# Altium project UTHP Truck Cape.PrjPcb (part 2 of 2)

## Sheet UTHP J1708 LIN RTC.SchDoc: Ultimate Truck Hacking Platform
size Letter; Author: Systems Cyber Research Group; Address1: Jeremy Daily; Address2: Thomas Balzer; Address3: Carson Green; Address4: Fort Collins, CO; DocumentNumber: I2C and J1708; Revision: 1; SheetNumber: 6; SheetTotal: 6; ENG_APP_DATE: --/--/--; DSN_APP_DATE: --/--/--; CHK_APP_DATE: --/--/--
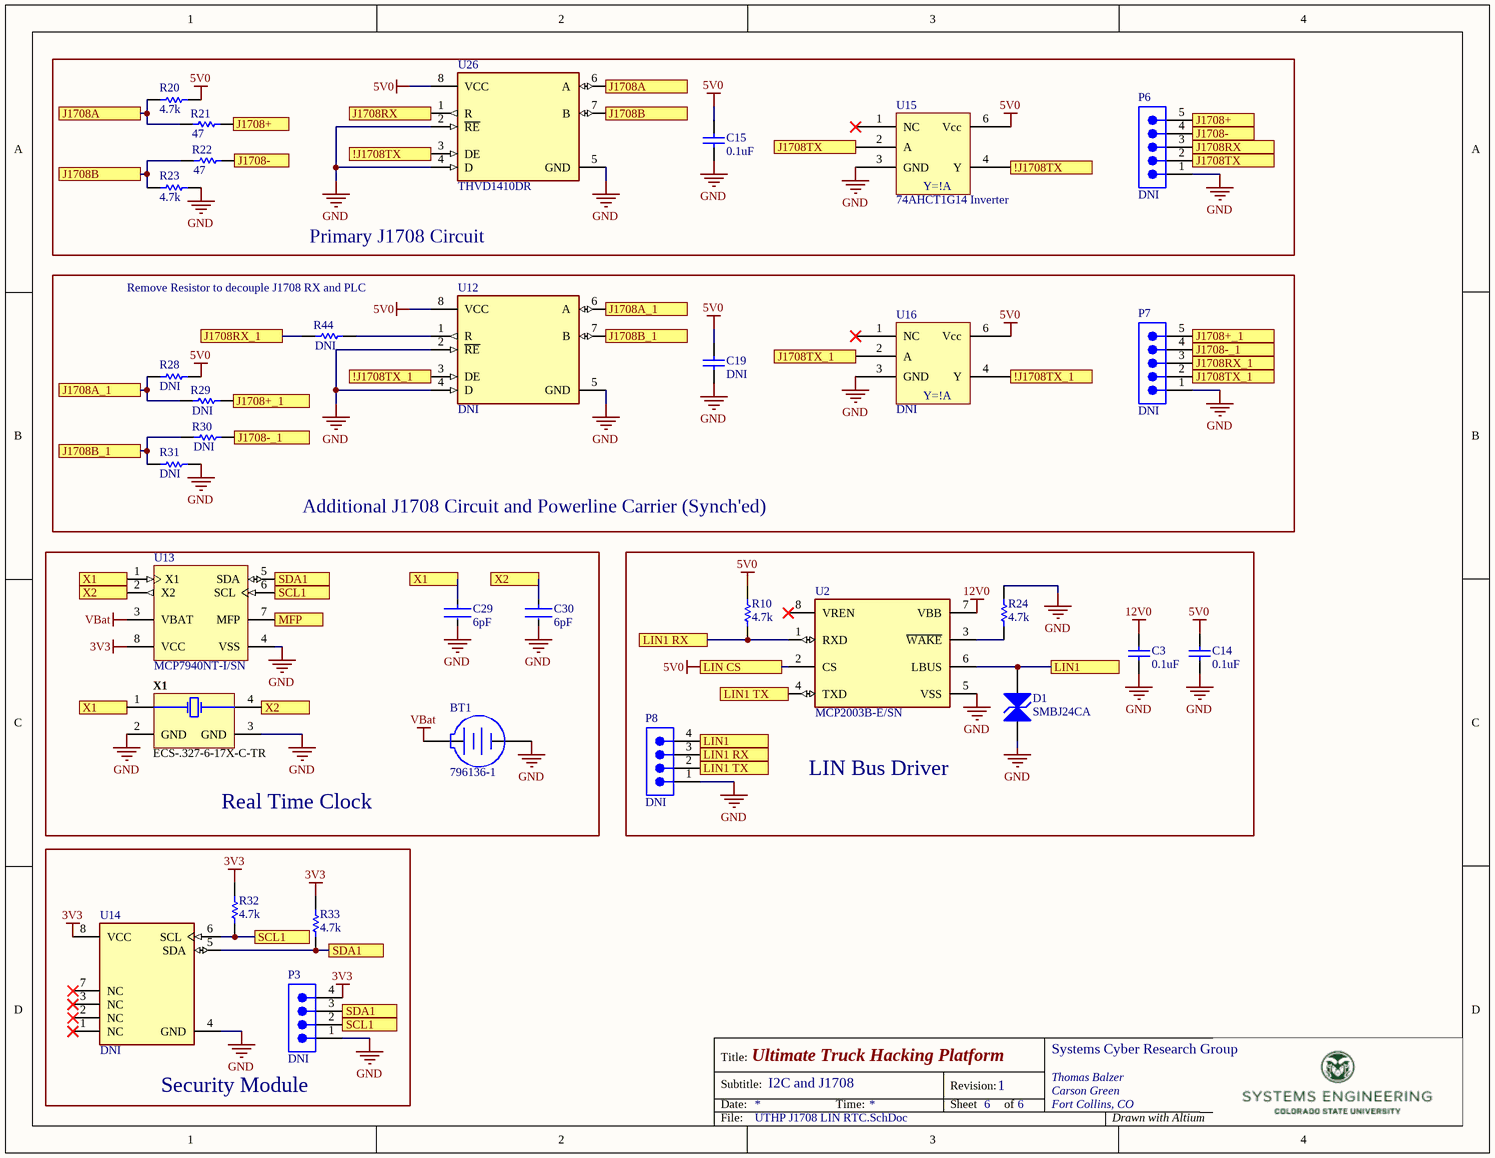
[diagram p5: UTHP J1708 LIN RTC.SchDoc]

### Parts
BT1  796136-1  [TECO-796136-1_V]
C3  0.1uF  [CAPC1608X90X35LL15T15]
C14  0.1uF  [CAPC1608X90X35LL15T15]
C15  0.1uF  [CAPC1608X90X35LL15T15]
C19  DNI  [CAPC1608X90X35LL15T15]
C29  6pF  [FP-CGA3E-0_3-0_1-MFG]
C30  6pF  [FP-CGA3E-0_3-0_1-MFG]
D1  SMBJ24CA  [VISH-DO-214AA-A-2_V]
P3  DNI  [61300411121]
P6  DNI  [61300511121]
P7  DNI  [61300511121]
P8  DNI  [61300411121]
R10  4.7k  [RESC1608X55X30NL15T15]
R20  4.7k  [RESC1608X55X30NL15T15]
R21  47  [RESC1609X50X30LL10T20]
R22  47  [RESC1609X50X30LL10T20]
R23  4.7k  [RESC1608X55X30NL15T15]
R24  4.7k  [RESC1608X55X30NL15T15]
R28  DNI  [RESC1608X55X30NL15T15]
R29  DNI  [RESC1609X50X30LL10T20]
R30  DNI  [RESC1609X50X30LL10T20]
R31  DNI  [RESC1608X55X30NL15T15]
R32  4.7k  [RESC1608X55X30NL15T15]
R33  4.7k  [RESC1608X55X30NL15T15]
R44  DNI  [RESC1609X50X30LL10T20]
U2  MCP2003B-E/SN  [FP-C04-057-IPC_B]
U12  DNI  [FP-D0008A-IPC_B]
U13  MCP7940NT-I/SN  [SOIC-SN8_M]
U14  DNI  [FP-C04-057-OA-MFG]
U15  74AHCT1G14 Inverter  [SOT-353]
U16  DNI  [SOT-353]
U26  THVD1410DR  [FP-D0008A-IPC_B]
X1  ECS-.327-6-17X-C-TR  [ECS-.327-6-17X-C-TR-Footprint-1]

### Blocks framed on the sheet
Primary J1708 Circuit: C15 P6 R20-R23 U15 U26
Additional J1708 Circuit and Powerline Carrier (Synch'ed): C19 P7 R28-R31 R44 U12 U16
Real Time Clock: BT1 C29 C30 U13 X1
LIN Bus Driver: C3 C14 D1 P8 R10 R24 U2
Security Module: P3 R32 R33 U14

### Ports
!J1708TX, !J1708TX_1, J1708+, J1708+_1, J1708-, J1708-_1, J1708A, J1708A_1, J1708B, J1708B_1, J1708RX, J1708RX_1, J1708TX, J1708TX_1, LIN1, LIN1 RX, LIN1 TX, LIN CS, MFP, SCL1, SDA1, X1, X2

### Nets
3V3: P3.4 R32.1 R33.1 U13.8(VCC) U14.8(VCC)
5V0: C14.1 C15.1 C19.1 R10.2 R20.1 R28.1 U2.2(CS) U12.8(VCC) U15.6(Vcc) U16.6(Vcc) U26.8(VCC) ; port LIN CS
12V0: C3.1 U2.7(VBB)
GND: BT1.2(-) C3.2 C14.2 C15.2 C19.2 C29.2 C30.2 D1.1(A) P3.1 P6.1 P7.1 P8.1 R23.1 R24.2 R31.1 U2.5(VSS) U12.2(~{RE}) U12.4(D) U12.5(GND) U13.4(VSS) U14.4(GND) U15.3(GND) U16.3(GND) U26.2(~{RE}) U26.4(D) U26.5(GND) X1.2(GND) X1.3(GND)
VBat: BT1.1(+) U13.3(VBAT)
!J1708TX: U15.4(Y) U26.3(DE) ; port !J1708TX
!J1708TX_1: U12.3(DE) U16.4(Y) ; port !J1708TX_1
J1708+: P6.5 R21.2 ; port J1708+
J1708+_1: P7.5 R29.2 ; port J1708+_1
J1708-: P6.4 R22.2 ; port J1708-
J1708-_1: P7.4 R30.2 ; port J1708-_1
J1708A: R20.2 R21.1 U26.6(A) ; port J1708A
J1708A_1: R28.2 R29.1 U12.6(A) ; port J1708A_1
J1708B: R22.1 R23.2 U26.7(B) ; port J1708B
J1708B_1: R30.1 R31.2 U12.7(B) ; port J1708B_1
J1708RX: P6.3 U26.1(R) ; port J1708RX
J1708RX_1: P7.3 R44.1 ; port J1708RX_1
J1708TX: P6.2 U15.2(A) ; port J1708TX
J1708TX_1: P7.2 U16.2(A) ; port J1708TX_1
LIN1: D1.2(A) P8.4 U2.6(LBUS) ; port LIN1
LIN1 RX: P8.3 R10.1 U2.1(RXD) ; port LIN1 RX
LIN1 TX: P8.2 U2.4(TXD) ; port LIN1 TX
MFP: U13.7(MFP) ; port MFP
SCL1: P3.2 R32.2 U13.6(SCL) U14.6(SCL) ; port SCL1
SDA1: P3.3 R33.2 U13.5(SDA) U14.5(SDA) ; port SDA1
X1: C29.1 U13.1(X1) X1.1(X1) ; port X1
X2: C30.1 U13.2(X2) X1.4(X2) ; port X2
NetR24_1: R24.1 U2.3(~{WAKE})
NetR44_2: R44.2 U12.1(R)

Not connected (* = marked no-connect by the designer): U2 8(VREN)*; U14 1(NC)* 2(NC)* 3(NC)* 7(NC)*; U15 1(NC)*; U16 1(NC)*

### Notes on the sheet
- (near R44) Remove Resistor to decouple J1708 RX and PLC
- Title:
- Subtitle:
- Date:
- Time:
- Revision:
- Sheet
- of
- File:
- Drawn with Altium
- (in symbol CMP-023-000006-1) Y=!A

### Library data of the parts
BT1 = CMP-002-00002-2: Battery Connector, 1 Cell, CR2032, 2-Pin SMD, RoHS, Tape and Reel; Manufacturer: TE Connectivity; Max Voltage Rating (AC): 30V; Connector Type: BatteryHolder; Batteries: 1; Datasheet URL: http://www.te.com/commerce/DocumentDelivery/DDEController?Action=srchrtrv&DocNm=796136&DocType=Customer+Drawing&DocLang=English&DocFormat=pdf&PartCntxt=796136-1; Contact Plating: Tin; Case/Package: 796136-1; Colour: Black; Package Reference: 796136-1; Package Quantity: 400; Pins: 2; Mounting Technology: SM; RoHS Compliant: True; Datasheet Version: Dec-13; Package Description: 2-Pin Surface Mount Device, Body 32.31 x 19.05 mm; Packaging: TapeandReel; Manufacturer URL: http://www.te.com/; Contact Material: Bronze
C3 C14 C15 = CMP-2006-04387-1: 0.1 µF ±10% 50V Ceramic Capacitor X7R 0603 (1608 Metric); Manufacturer: KYOCERA AVX; Part Number: KAM15AR71H104KM; Supplier 1: Digi-Key; Supplier Part Number 1: 478-KAM15AR71H104KMTR-ND; Value: 0.1uF
C19 = CMP-2006-04387-1: 0.1 µF ±10% 50V Ceramic Capacitor X7R 0603 (1608 Metric); Manufacturer: KYOCERA AVX; Part Number: KAM15AR71H104KM; Value: 0.1uF; Supplier 1: Digi-Key; Supplier Part Number 1: 478-KAM15AR71H104KMTR-ND
C29 C30 = CMP-08246-001317-1: Cap Ceramic 6pF 50V C0G 0.5pF Pad SMD 0603 +125°C Automotive T/R CGA3E2C0G1H060D080AA; Manufacturer: TDK Corporation; Part Number: CGA3E2C0G1H060D080AA; Supplier 1: Digi-Key; Supplier Part Number 1: 445-5623-1-ND; Value: 6pF
D1 = CMP-2000-07094-1: TRANSZORB(R) Transient Voltage Suppressor, 24 V, -55 to 150 degC, 2-Pin DO-214AA (SMBJ), RoHS, Tape and Reel; Manufacturer: Vishay; Part Number: SMBJ24CA-E3/52; Value: TVS Diode; Supplier 1: Digi-Key; Supplier Part Number 1: SMBJ24CA-E3/52GICT-ND
P3 = CMP-1502-01064-2
P6 P7 = CMP-1502-01068-2: NexarPartId: 32855526; Operating Supply Voltage: 250V; Number of Contacts: 5; Connector Type: Male Pin; Current Rating: 3A; Contact Resistance: 20mΩ; Pitch: 2.54mm; Gender: Male; Termination: Solder; RoHS: Compliant; Lead Pitch: 2.54mm; Contact Mating Length: 5.9944mm; Number of Positions: 5; Lead Free: Lead Free; Contact Plating: Gold; Number of Pins: 5; Min Operating Temperature: -40°C; Voltage Rating: 250V; Color: Black; Mount: Through Hole; REACH SVHC: Unknown; Packaging: Bulk; Height: 8.89mm; Number of Rows: 1; Orientation: Vertical; Contact Material: Copper; Max Operating Temperature: 105°C
P8 = CMP-1502-01064-2: NexarPartId: 32855522; Pitch: 2.54mm; Number of Contacts: 4; Contact Resistance: 20mΩ; Gender: Male; Current Rating: 3A; Connector Type: Male Pin; Voltage Rating: 250V; Lead Free: Lead Free; Contact Plating: Gold; Max Operating Temperature: 105°C; Packaging: Bulk; Height: 8.89mm; Orientation: Vertical; Contact Mating Length: 5.9944mm; Contact Material: Copper; Lead Pitch: 2.54mm; Min Operating Temperature: -40°C; Termination: Solder; Color: Black; Number of Rows: 1; REACH SVHC: Unknown; RoHS: Compliant; Mount: Through Hole; Number of Positions: 4; Number of Pins: 4; Operating Supply Voltage: 250V
R10 R20 R23 R24 R32 R33 = CMP-1012-00586-3: 4.7 kOhms ±1% 0.1W, 1/10W Chip Resistor 0603 (1608 Metric) Automotive AEC-Q200 Thick Film; Manufacturer: Panasonic Electronic Components; Part Number: ERJ-3EKF4701V; Supplier 1: Digi-Key; Supplier Part Number 1: P4.70KHCT-ND; Value: 4.7k
R21 R22 = CMP-2000-03383-1: as R17 on sheet UTHP Power Supply and PLC; Part Number: CRCW060347R0FKEA; Supplier 1: Digi-Key; Supplier Part Number 1: 541-47.0HCT-ND; Value: 47
R28 R31 = CMP-1012-00586-3: 4.7 kOhms ±1% 0.1W, 1/10W Chip Resistor 0603 (1608 Metric) Automotive AEC-Q200 Thick Film; Manufacturer: Panasonic Electronic Components; Part Number: ERJ-3EKF4701V; Value: 4.7k; Supplier 1: Digi-Key; Supplier Part Number 1: P4.70KHCT-ND
R29 R30 R44 = CMP-2000-03383-1: CRCW060347R0FKEA Res Thick Film 0603 47 Ohm 1% 1/10W ±100ppm/°C Molded SMD Paper T/R; Manufacturer: Vishay Dale; Value: 47; Part Number: CRCW060347R0FKEA; Supplier 1: Digi-Key; Supplier Part Number 1: 541-47.0HCT-ND
U2 = CMP-06279-000013-1: IC TRANSCEIVER HALF 1/1 8SOIC
U12 = CMP-04875-000079-1: 1/1 Transceiver Half RS485 8-SOIC; Manufacturer: Texas Instruments; Part Number: THVD1410DR; Value: Half-Duplex Transcieiver; Supplier 1: Digi-Key; Supplier Part Number 1: 296-THVD1410DRCT-ND
U13 = CMP-0186-00194-1: Real Time Clock (RTC) IC Clock/Calendar 64B I²C, 2-Wire Serial 8-SOIC (0.154", 3.90mm Width); Manufacturer: Microchip; Part Number: MCP7940NT-I/SN; Supplier 1: Digi-Key; Supplier Part Number 1: MCP7940NT-I/SNCT-ND; Value: RTC
U14 = CMP-06260-000004-1: Authentication Chip 8-SOIC\; Manufacturer: Microchip; Part Number: ATECC608A-SSHDA-B; Value: Security Module; Supplier 1: Digi-Key; Supplier Part Number 1: ATECC608A-SSHDA-B-ND
U15 U16 = CMP-023-000006-1: Single Schmidt Trigger Inverter
U26 = CMP-04875-000079-1: 1/1 Transceiver Half RS485 8-SOIC; Manufacturer: Texas Instruments; Value: Half-Duplex Transcieiver; Part Number: THVD1410DR; Supplier 1: Digi-Key; Supplier Part Number 1: 296-THVD1410DRCT-ND
X1 = CMP-003-00030-1: ECX306X Series 32.76 kHz ±10 ppm 6 pF -40 to +85 °C Surface Mount Crystal

## Nets that join several sheets
2V5: UTHP Edge Connectors (C16.1 SW1.1 U1.2), UTHP Buffer Circuits (C34.1 R14.1)
3V3: UTHP BeagleBone Headers (BeagleBoneBlack.3 BeagleBoneBlack.4 DS3.1 R11.2), UTHP CAN Connections (8 pins), UTHP Edge Connectors (MB1.7), UTHP Buffer Circuits (11 pins), UTHP J1708 LIN RTC (5 pins)
5V0: UTHP BeagleBone Headers (BeagleBoneBlack.5 BeagleBoneBlack.6 J3.15), UTHP Edge Connectors (C24.1 MB1.10 U1.1), UTHP Power Supply and PLC (7 pins), UTHP Buffer Circuits (6 pins), UTHP J1708 LIN RTC (11 pins)
12V0: UTHP Power Supply and PLC (10 pins), UTHP Buffer Circuits (R13.1), UTHP J1708 LIN RTC (C3.1 U2.7)
GND: UTHP BeagleBone Headers (19 pins), UTHP CAN Connections (23 pins), UTHP Edge Connectors (13 pins), UTHP Power Supply and PLC (32 pins), UTHP Buffer Circuits (26 pins), UTHP J1708 LIN RTC (28 pins)
RAW: UTHP BeagleBone Headers (J3.17 J3.19), UTHP Edge Connectors (J1.2 J8.8), UTHP Power Supply and PLC (C1.1 C2.2 L1.1 P485.8), UTHP Buffer Circuits (C28.1)
SYS 5V: UTHP BeagleBone Headers (BeagleBoneBlack.7 BeagleBoneBlack.8), UTHP CAN Connections (8 pins)
5VPLC: UTHP Power Supply and PLC (R17.1), UTHP Buffer Circuits (6 pins)
AIN0: UTHP BeagleBone Headers (BeagleBoneBlack.39), UTHP Edge Connectors (R25.1 U18.1 U18.4)
AIN1: UTHP BeagleBone Headers (BeagleBoneBlack.40), UTHP Edge Connectors (R19.1 U9.1 U9.4)
BBB RST: UTHP BeagleBone Headers (BeagleBoneBlack.P31), UTHP Buffer Circuits (U27.32)
BUF_EN: UTHP BeagleBone Headers (BeagleBoneBlack.23 R11.1), UTHP Buffer Circuits (U11.25 U11.48 U27.25 U27.48)
CAN1H: UTHP BeagleBone Headers (J3.1), UTHP CAN Connections (P2.3 U3.7), UTHP Edge Connectors (J1.3 J8.13)
CAN1L: UTHP BeagleBone Headers (J3.2), UTHP CAN Connections (P2.2 U3.6), UTHP Edge Connectors (J1.4 J8.12)
CAN2H: UTHP BeagleBone Headers (J3.3), UTHP CAN Connections (P4.3 U4.7), UTHP Edge Connectors (J1.8 J8.5)
CAN2L: UTHP BeagleBone Headers (J3.4), UTHP CAN Connections (P4.2 U4.6), UTHP Edge Connectors (J1.9 J8.10)
CAN3H: UTHP BeagleBone Headers (J3.5), UTHP CAN Connections (U5.7), UTHP Edge Connectors (J1.6 J8.2)
CAN3L: UTHP BeagleBone Headers (J3.6), UTHP CAN Connections (U5.6), UTHP Edge Connectors (J1.7 J8.3)
CAN3RX: UTHP BeagleBone Headers (J2.5 R26.1), UTHP CAN Connections (P5.10 U5.4 U6.2)
CAN4H: UTHP BeagleBone Headers (J3.7), UTHP CAN Connections (U7.7), UTHP Edge Connectors (J8.1)
CAN4L: UTHP BeagleBone Headers (J3.8), UTHP CAN Connections (U7.6), UTHP Edge Connectors (J8.9)
CAN4RX: UTHP BeagleBone Headers (J2.7 R27.1), UTHP CAN Connections (P5.12 U7.4 U8.2)
Click INT: UTHP BeagleBone Headers (BeagleBoneBlack.P45), UTHP Edge Connectors (MB1.15), UTHP Buffer Circuits (U27.33)
Click RST: UTHP Edge Connectors (MB1.2), UTHP Buffer Circuits (U27.17)
Click SPI CS: UTHP Edge Connectors (MB1.3), UTHP Buffer Circuits (U27.14)
CS0_MCP: UTHP CAN Connections (P5.5 U6.13), UTHP Buffer Circuits (U27.2)
CS1_MCP: UTHP CAN Connections (P5.6 U8.13), UTHP Buffer Circuits (U27.3)
DCAN0 RX: UTHP BeagleBone Headers (BeagleBoneBlack.19 BeagleBoneBlack.P12), UTHP Buffer Circuits (U27.19)
DCAN0 RX_RAW: UTHP BeagleBone Headers (J2.3 R39.1), UTHP CAN Connections (P2.5 U3.4), UTHP Buffer Circuits (U27.30)
DCAN0 TX: UTHP BeagleBone Headers (BeagleBoneBlack.20 BeagleBoneBlack.P14), UTHP CAN Connections (P2.4 U3.1)
DCAN1 RX: UTHP BeagleBone Headers (BeagleBoneBlack.24 BeagleBoneBlack.P16), UTHP Buffer Circuits (U27.20)
DCAN1 RX_RAW: UTHP BeagleBone Headers (J2.1 R1.1), UTHP CAN Connections (P4.5 U4.4), UTHP Buffer Circuits (U27.29)
DCAN1 TX: UTHP BeagleBone Headers (BeagleBoneBlack.26 BeagleBoneBlack.P18), UTHP CAN Connections (P4.4 U4.1)
ECAPPWM0: UTHP BeagleBone Headers (BeagleBoneBlack.42), UTHP Buffer Circuits (U11.6)
GND_ADC: UTHP BeagleBone Headers (BeagleBoneBlack.34), UTHP Edge Connectors (R19.2 R25.2 U9.2 U18.2)
GPIO_61: UTHP BeagleBone Headers (BeagleBoneBlack.P26), UTHP Buffer Circuits (U11.8)
GPIO_88: UTHP BeagleBone Headers (BeagleBoneBlack.P28), UTHP Buffer Circuits (U11.9)
IdleLineDetect: UTHP Power Supply and PLC (P485.2), UTHP Buffer Circuits (U11.40)
INT0: UTHP BeagleBone Headers (BeagleBoneBlack.P13), UTHP Buffer Circuits (U27.22)
INT0_MCP: UTHP CAN Connections (P5.7 U6.4), UTHP Buffer Circuits (U27.27)
INT1: UTHP BeagleBone Headers (BeagleBoneBlack.P11), UTHP Buffer Circuits (U27.23)
INT1_MCP: UTHP CAN Connections (P5.8 U8.4), UTHP Buffer Circuits (U27.26)
INT2: UTHP BeagleBone Headers (BeagleBoneBlack.P32), UTHP Buffer Circuits (U27.16)
J1708+: UTHP BeagleBone Headers (J3.9), UTHP Edge Connectors (J8.15), UTHP J1708 LIN RTC (P6.5 R21.2)
J1708+_1: UTHP BeagleBone Headers (J3.11), UTHP Edge Connectors (J8.4), UTHP J1708 LIN RTC (P7.5 R29.2)
J1708-: UTHP BeagleBone Headers (J3.10), UTHP Edge Connectors (J8.14), UTHP J1708 LIN RTC (P6.4 R22.2)
J1708-_1: UTHP BeagleBone Headers (J3.12), UTHP Edge Connectors (J8.11), UTHP J1708 LIN RTC (P7.4 R30.2)
J1708RX: UTHP BeagleBone Headers (J2.2 R2.2), UTHP Buffer Circuits (U11.46), UTHP J1708 LIN RTC (P6.3 U26.1)
J1708RX_1: UTHP BeagleBone Headers (J2.4 R40.2), UTHP Edge Connectors (MB1.13), UTHP Power Supply and PLC (P485.4), UTHP Buffer Circuits (U11.47), UTHP J1708 LIN RTC (P7.3 R44.1)
J1708TX: UTHP Buffer Circuits (U11.26), UTHP J1708 LIN RTC (P6.2 U15.2)
J1708TX_1: UTHP Edge Connectors (MB1.14), UTHP Power Supply and PLC (P485.3), UTHP Buffer Circuits (U11.27), UTHP J1708 LIN RTC (P7.2 U16.2)
LIN1: UTHP BeagleBone Headers (J3.14), UTHP J1708 LIN RTC (D1.2 P8.4 U2.6)
LIN1 RX: UTHP Buffer Circuits (U11.44), UTHP J1708 LIN RTC (P8.3 R10.1 U2.1)
LIN1 TX: UTHP Buffer Circuits (U27.13), UTHP J1708 LIN RTC (P8.2 U2.4)
PLC Signal: UTHP BeagleBone Headers (J3.13), UTHP Edge Connectors (C27.1)
PWM1B: UTHP BeagleBone Headers (BeagleBoneBlack.16), UTHP Buffer Circuits (U11.13)
PWM2A: UTHP BeagleBone Headers (BeagleBoneBlack.P19), UTHP Buffer Circuits (U11.14)
PWMOUT1: UTHP Edge Connectors (J10.1), UTHP Power Supply and PLC (C1.2), UTHP Buffer Circuits (U11.36)
PWMOUT2: UTHP Edge Connectors (J10.3), UTHP Buffer Circuits (U11.35)
PWMOUT3: UTHP Edge Connectors (J10.5 MB1.16), UTHP Buffer Circuits (U11.33)
PWMOUT4: UTHP Edge Connectors (J10.7), UTHP Buffer Circuits (U11.32)
PWMOUT5: UTHP Edge Connectors (J10.9), UTHP Buffer Circuits (U11.30)
PWMOUT6: UTHP Edge Connectors (J10.11), UTHP Buffer Circuits (U11.29)
SafePLC: UTHP BeagleBone Headers (J2.6 R41.2), UTHP Buffer Circuits (U11.11)
SCK0_MCP: UTHP CAN Connections (P5.2 U6.10 U8.10), UTHP Buffer Circuits (U27.5)
SCL1: UTHP Edge Connectors (MB1.12), UTHP J1708 LIN RTC (P3.2 R32.2 U13.6 U14.6)
SDA1: UTHP Edge Connectors (MB1.11), UTHP J1708 LIN RTC (P3.3 R33.2 U13.5 U14.5)
SDI0_MCP: UTHP CAN Connections (P5.3 U6.11 U8.11), UTHP Buffer Circuits (U27.8)
SDO0_MCP: UTHP CAN Connections (P5.4 U6.12 U8.12), UTHP Buffer Circuits (U27.38)
SPI1_CS0: UTHP BeagleBone Headers (BeagleBoneBlack.28), UTHP Buffer Circuits (U27.47)
SPI1_CS1: UTHP BeagleBone Headers (BeagleBoneBlack.27), UTHP Buffer Circuits (U27.46)
SPI1_CS2: UTHP BeagleBone Headers (BeagleBoneBlack.15), UTHP Buffer Circuits (U27.35)
SPI1_D0: UTHP BeagleBone Headers (BeagleBoneBlack.29), UTHP Buffer Circuits (U27.40)
SPI1_D1: UTHP BeagleBone Headers (BeagleBoneBlack.30), UTHP Buffer Circuits (U27.12)
SPI1_SCLK: UTHP BeagleBone Headers (BeagleBoneBlack.31), UTHP Buffer Circuits (U27.43)
TIMER4: UTHP BeagleBone Headers (BeagleBoneBlack.P7), UTHP Buffer Circuits (U11.16)
TIMER5: UTHP BeagleBone Headers (BeagleBoneBlack.P9), UTHP Buffer Circuits (U11.17)
TIMER6: UTHP BeagleBone Headers (BeagleBoneBlack.P10), UTHP Buffer Circuits (U11.19)
TIMER7: UTHP BeagleBone Headers (BeagleBoneBlack.P8), UTHP Buffer Circuits (U11.20)
UART2_RX: UTHP BeagleBone Headers (BeagleBoneBlack.14 BeagleBoneBlack.22), UTHP Buffer Circuits (U11.3)
UART2_TX: UTHP BeagleBone Headers (BeagleBoneBlack.21), UTHP Buffer Circuits (U11.23)
UART4_RX: UTHP BeagleBone Headers (BeagleBoneBlack.11 BeagleBoneBlack.12), UTHP Buffer Circuits (U11.2)
UART4_TX: UTHP BeagleBone Headers (BeagleBoneBlack.13), UTHP Buffer Circuits (U11.22)
UART 5 RX: UTHP BeagleBone Headers (BeagleBoneBlack.P38 J2.8 R42.2), UTHP Buffer Circuits (U11.5)
UART 5 TX: UTHP BeagleBone Headers (BeagleBoneBlack.P37), UTHP Buffer Circuits (U27.36)
VDD_ADC: UTHP BeagleBone Headers (BeagleBoneBlack.32), UTHP Edge Connectors (5 pins)